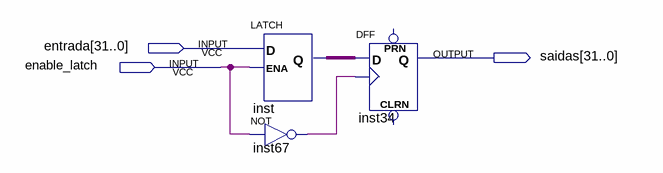
[diagram p0: schematic sheet]
// Quartus schematic Barramento_32x.bdf as structural Verilog: 3 symbols, 3 pins
module Barramento_32x (
  input  [31:0] entrada,
  input  enable_latch,
  output [31:0] saidas
);

  wire inst67_out, inst_q;

  LATCH inst[31:0] (.D(entrada), .ENA(enable_latch), .Q(inst_q));
  not inst67 (inst67_out, enable_latch);
  DFF inst34[31:0] (.CLK(inst67_out), .D(inst_q), .Q(saidas));  // open: CLRN, PRN
endmodule
